# Altium schematic sheet MCU.SchDoc: MCU
size A3; CompanyName: Novelda AS; Organization: Novelda AS; Address1: Gjerdrums vei 8; Address2: NO-0484 Oslo; Address3: Norway; Revision: 1.A; SheetNumber: 3; SheetTotal: 3; Classification: Restricted; Size: A3; Project: X4M01; ProjectName: Prosject Name
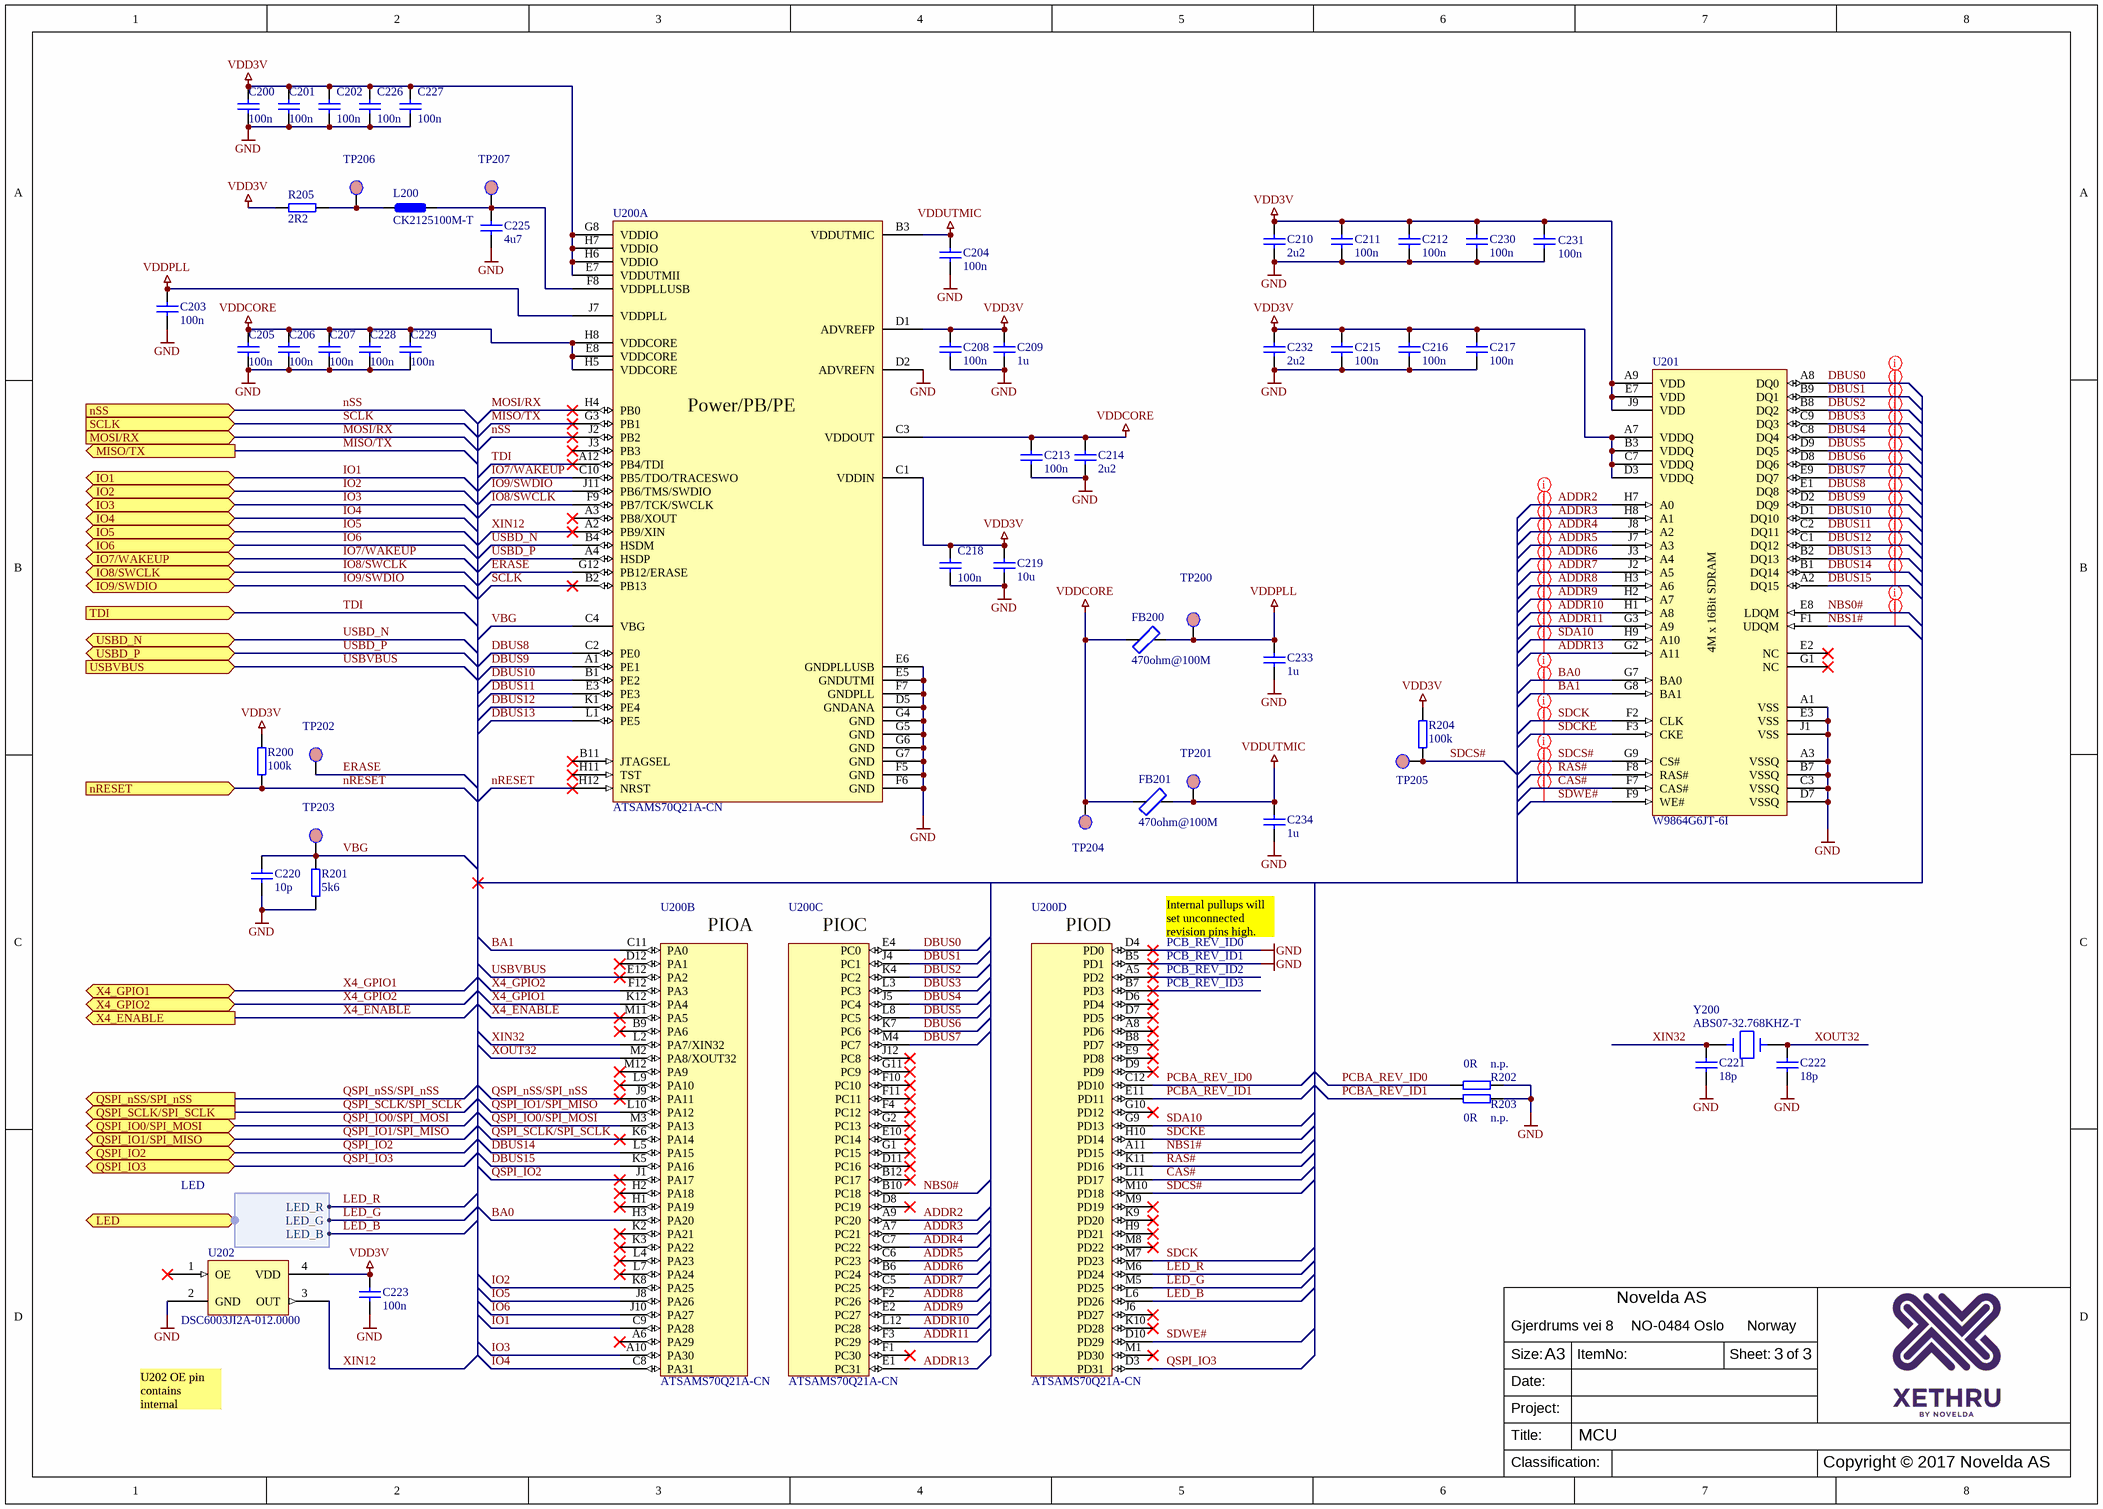
[diagram p0: MCU.SchDoc]

## Parts
C200  100n  [0402-CAPACITOR-NONPOL]
C201  100n  [0402-CAPACITOR-NONPOL]
C202  100n  [0402-CAPACITOR-NONPOL]
C203  100n  [0402-CAPACITOR-NONPOL]
C204  100n  [0402-CAPACITOR-NONPOL]
C205  100n  [0402-CAPACITOR-NONPOL]
C206  100n  [0402-CAPACITOR-NONPOL]
C207  100n  [0402-CAPACITOR-NONPOL]
C208  100n  [0402-CAPACITOR-NONPOL]
C209  1u  [0402-CAPACITOR-NONPOL]
C210  2u2  [0402-CAPACITOR-NONPOL]
C211  100n  [0402-CAPACITOR-NONPOL]
C212  100n  [0402-CAPACITOR-NONPOL]
C213  100n  [0402-CAPACITOR-NONPOL]
C214  2u2  [0402-CAPACITOR-NONPOL]
C215  100n  [0402-CAPACITOR-NONPOL]
C216  100n  [0402-CAPACITOR-NONPOL]
C217  100n  [0402-CAPACITOR-NONPOL]
C218  100n  [0402-CAPACITOR-NONPOL]
C219  10u  [0603-CAPACITOR-NONPOL]
C220  10p  [0402-CAPACITOR-NONPOL]
C221  18p  [0402-CAPACITOR-NONPOL]
C222  18p  [0402-CAPACITOR-NONPOL]
C223  100n  [0402-CAPACITOR-NONPOL]
C225  4u7  [0603-CAPACITOR-NONPOL]
C226  100n  [0402-CAPACITOR-NONPOL]
C227  100n  [0402-CAPACITOR-NONPOL]
C228  100n  [0402-CAPACITOR-NONPOL]
C229  100n  [0402-CAPACITOR-NONPOL]
C230  100n  [0402-CAPACITOR-NONPOL]
C231  100n  [0402-CAPACITOR-NONPOL]
C232  2u2  [0402-CAPACITOR-NONPOL]
C233  1u  [0402-CAPACITOR-NONPOL]
C234  1u  [0402-CAPACITOR-NONPOL]
FB200  470ohm@100M  [200047]
FB201  470ohm@100M  [200047]
L200  CK2125100M-T  [200364]
R200  100k  [0402-RESISTOR]
R201  5k6  [0402-RESISTOR]
R202  0R  Notes: n.p.  [0402-RESISTOR]
R203  0R  Notes: n.p.  [0402-RESISTOR]
R204  100k  [0402-RESISTOR]
R205  2R2  [0402-RESISTOR]
TP200  TP-MDA  [ALTIUM-0001]  (value not drawn)  (no BOM)
TP201  TP-MDA  [ALTIUM-0001]  (value not drawn)  (no BOM)
TP202  TP-MDA  [ALTIUM-0001]  (value not drawn)  (no BOM)
TP203  TP-MDA  [ALTIUM-0001]  (value not drawn)  (no BOM)
TP204  TP-MDA  [ALTIUM-0001]  (value not drawn)  (no BOM)
TP205  TP-MDA  [ALTIUM-0001]  (value not drawn)  (no BOM)
TP206  TP-MDA  [ALTIUM-0001]  (value not drawn)  (no BOM)
TP207  TP-MDA  [ALTIUM-0001]  (value not drawn)  (no BOM)
U200  ATSAMS70Q21A-CN  [200353]  (parts A,B,C,D of 4)
U201  W9864G6JT-6I  [200282]
U202  DSC6003JI2A-012.0000  [200365]
Y200  ABS07-32.768KHZ-T  [200042]

## Ports
IO1 (bidir), IO2 (bidir), IO3 (bidir), IO4 (bidir), IO5 (bidir), IO6 (bidir), IO7/WAKEUP (bidir), IO8/SWCLK (bidir), IO9/SWDIO (bidir), LED (harness LED), MISO/TX (out), MOSI/RX (in), nRESET (in), nSS (in), QSPI_IO0/SPI_MOSI (bidir), QSPI_IO1/SPI_MISO (bidir), QSPI_IO2 (bidir), QSPI_IO3 (bidir), QSPI_nSS/SPI_nSS (out), QSPI_SCLK/SPI_SCLK (out), SCLK (in), TDI (in), USBD_N (bidir), USBD_P (bidir), USBVBUS (in), X4_ENABLE (out), X4_GPIO1 (bidir), X4_GPIO2 (bidir)

## Harnesses
LED: LED_R, LED_B, LED_G

## Nets
GND: C200.2 C201.1 C202.1 C203.1 C204.1 C205.2 C206.1 C207.1 C208.1 C209.1 C210.2 C211.1 C212.1 C213.1 C214.2 C215.1 C216.1 C217.1 C218.1 C219.1 C220.2 C221.1 C222.1 C223.2 C225.1 C226.1 C227.1 C228.1 C229.1 C230.1 C231.1 C232.2 C233.1 C234.1 R201.1 R202.2 R203.2 U200.B5(PD1) U200.D2(ADVREFN) U200.D4(PD0) U200.D5(GNDANA) U200.E5(GNDUTMI) U200.E6(GNDPLLUSB) U200.F5(GND) U200.F6(GND) U200.F7(GNDPLL) U200.G4(GND) U200.G5(GND) U200.G6(GND) U200.G7(GND) U201.A1(VSS) U201.A3(VSSQ) U201.B7(VSSQ) U201.C3(VSSQ) U201.D7(VSSQ) U201.E3(VSS) U201.J1(VSS) U202.2(GND)
VDD3V: C200.1 C201.2 C202.2 C208.2 C209.2 C210.1 C211.2 C212.2 C215.2 C216.2 C217.2 C218.2 C219.2 C223.1 C226.2 C227.2 C230.2 C231.2 C232.1 R200.2 R204.2 R205.1 U200.C1(VDDIN) U200.D1(ADVREFP) U200.E7(VDDUTMII) U200.G8(VDDIO) U200.H6(VDDIO) U200.H7(VDDIO) U201.A7(VDDQ) U201.A9(VDD) U201.B3(VDDQ) U201.C7(VDDQ) U201.D3(VDDQ) U201.E7(VDD) U201.J9(VDD) U202.4(VDD)
VDDCORE: C205.1 C206.2 C207.2 C213.2 C214.1 C228.2 C229.2 FB200.1 FB201.1 TP204.1 U200.C3(VDDOUT) U200.E8(VDDCORE) U200.H5(VDDCORE) U200.H8(VDDCORE)
VDDPLL: C203.2 C233.2 FB200.2 TP200.1 U200.J7(VDDPLL)
VDDUTMIC: C204.2 C234.2 FB201.2 TP201.1 U200.B3(VDDUTMIC)
ADDR2: U200.A9(PC20) U201.H7(A0)
ADDR3: U200.A7(PC21) U201.H8(A1)
ADDR4: U200.C7(PC22) U201.J8(A2)
ADDR5: U200.C6(PC23) U201.J7(A3)
ADDR6: U200.B6(PC24) U201.J3(A4)
ADDR7: U200.C5(PC25) U201.J2(A5)
ADDR8: U200.F2(PC26) U201.H3(A6)
ADDR9: U200.E2(PC27) U201.H2(A7)
ADDR10: U200.L12(PC28) U201.H1(A8)
ADDR11: U200.F3(PC29) U201.G3(A9)
ADDR13: U200.E1(PC31) U201.G2(A11)
BA0: U200.H3(PA20) U201.G7(BA0)
BA1: U200.C11(PA0) U201.G8(BA1)
CAS#: U200.L11(PD17) U201.F7(CAS#)
DBUS0: U200.E4(PC0) U201.A8(DQ0)
DBUS1: U200.J4(PC1) U201.B9(DQ1)
DBUS2: U200.K4(PC2) U201.B8(DQ2)
DBUS3: U200.L3(PC3) U201.C9(DQ3)
DBUS4: U200.J5(PC4) U201.C8(DQ4)
DBUS5: U200.L8(PC5) U201.D9(DQ5)
DBUS6: U200.K7(PC6) U201.D8(DQ6)
DBUS7: U200.M4(PC7) U201.E9(DQ7)
DBUS8: U200.C2(PE0) U201.E1(DQ8)
DBUS9: U200.A1(PE1) U201.D2(DQ9)
DBUS10: U200.B1(PE2) U201.D1(DQ10)
DBUS11: U200.E3(PE3) U201.C2(DQ11)
DBUS12: U200.K1(PE4) U201.C1(DQ12)
DBUS13: U200.L1(PE5) U201.B2(DQ13)
DBUS14: U200.L5(PA15) U201.B1(DQ14)
DBUS15: U200.K5(PA16) U201.A2(DQ15)
ERASE: TP202.1 U200.G12(PB12/ERASE)
IO1: U200.C9(PA28) ; port IO1
IO2: U200.K8(PA25) ; port IO2
IO3: U200.A10(PA30) ; port IO3
IO4: U200.C8(PA31) ; port IO4
IO5: U200.J8(PA26) ; port IO5
IO6: U200.J10(PA27) ; port IO6
IO7/WAKEUP: U200.C10(PB5/TDO/TRACESWO) ; port IO7/WAKEUP
IO8/SWCLK: U200.F9(PB7/TCK/SWCLK) ; port IO8/SWCLK
IO9/SWDIO: U200.J11(PB6/TMS/SWDIO) ; port IO9/SWDIO
LED_B: U200.L6(PD26) ; port LED.LED_B
LED_G: U200.M5(PD25) ; port LED.LED_G
LED_R: U200.M6(PD24) ; port LED.LED_R
MISO/TX: U200.G3(PB1) ; port MISO/TX
MOSI/RX: U200.H4(PB0) ; port MOSI/RX
NBS0#: U200.B10(PC18) U201.E8(LDQM)
NBS1#: U200.A11(PD15) U201.F1(UDQM)
nRESET: R200.1 U200.H12(NRST) ; port nRESET
nSS: U200.J2(PB2) ; port nSS
PCBA_REV_ID0: R202.1 U200.C12(PD10)
PCBA_REV_ID1: R203.1 U200.E11(PD11)
QSPI_IO0/SPI_MOSI: U200.M3(PA13) ; port QSPI_IO0/SPI_MOSI
QSPI_IO1/SPI_MISO: U200.L10(PA12) ; port QSPI_IO1/SPI_MISO
QSPI_IO2: U200.J1(PA17) ; port QSPI_IO2
QSPI_IO3: U200.D3(PD31) ; port QSPI_IO3
QSPI_nSS/SPI_nSS: U200.J9(PA11) ; port QSPI_nSS/SPI_nSS
QSPI_SCLK/SPI_SCLK: U200.K6(PA14) ; port QSPI_SCLK/SPI_SCLK
RAS#: U200.K11(PD16) U201.F8(RAS#)
SCLK: U200.B2(PB13) ; port SCLK
SDA10: U200.G9(PD13) U201.H9(A10)
SDCK: U200.M7(PD23) U201.F2(CLK)
SDCKE: U200.H10(PD14) U201.F3(CKE)
SDCS#: R204.1 TP205.1 U200.M10(PD18) U201.G9(CS#)
SDWE#: U200.D10(PD29) U201.F9(WE#)
TDI: U200.A12(PB4/TDI) ; port TDI
USBD_N: U200.B4(HSDM) ; port USBD_N
USBD_P: U200.A4(HSDP) ; port USBD_P
USBVBUS: U200.E12(PA2) ; port USBVBUS
VBG: C220.1 R201.2 TP203.1 U200.C4(VBG)
X4_ENABLE: U200.M11(PA5) ; port X4_ENABLE
X4_GPIO1: U200.K12(PA4) ; port X4_GPIO1
X4_GPIO2: U200.F12(PA3) ; port X4_GPIO2
XIN12: U200.A2(PB9/XIN) U202.3(OUT)
XIN32: C221.2 U200.L2(PA7/XIN32) Y200.1
XOUT32: C222.2 U200.M2(PA8/XOUT32) Y200.2
NetC225_2: C225.2 L200.2 TP207.1 U200.F8(VDDPLLUSB)
NetL200_1: L200.1 R205.2 TP206.1

Not connected (* = marked no-connect by the designer): U200 A3(PB8/XOUT)* A5(PD2)* A6(PA29)* A8(PD6)* B7(PD3)* B8(PD7)* B9(PA6)* B11(JTAGSEL)* B12(PC17)* D6(PD4)* D7(PD5)* D8(PC19)* D9(PD9)* D11(PC16)* D12(PA1)* E9(PD8)* E10(PC14)* F1(PC30)* F4(PC12)* F10(PC10)* F11(PC11)* G1(PC15)* G2(PC13)* G10(PD12)* G11(PC9)* H1(PA19)* H2(PA18)* H9(PD21)* H11(TST)* J3(PB3)* J6(PD27)* J12(PC8)* K2(PA21)* K3(PA22)* K9(PD20)* K10(PD28)* L4(PA23)* L7(PA24)* L9(PA10)* M1(PD30)* M8(PD22)* M9(PD19)* M12(PA9)*; U201 E2(NC)* G1(NC)*; U202 1(OE)*

## Layout directives
net class ADDRESS_BUS: ADDR2, ADDR3, ADDR4, ADDR5, ADDR6, ADDR7, ADDR8, ADDR9, ADDR10, ADDR11, ADDR13, BA0, BA1, CAS#, NBS0#, NBS1#, RAS#, SDA10, SDCK, SDCKE, SDCS#, SDWE#
net class DATA_BUS: DBUS0, DBUS1, DBUS2, DBUS3, DBUS4, DBUS5, DBUS6, DBUS7, DBUS8, DBUS9, DBUS10, DBUS11, DBUS12, DBUS13, DBUS14, DBUS15

## Notes on the sheet
- PCB_REV_ID0
- PCB_REV_ID1
- PCB_REV_ID2
- PCB_REV_ID3
- Internal pullups will set unconnected revision pins high.
- U202 OE pin
  contains internal
  pull-up
- Size:
- Date:
- ItemNo:
- Sheet:
- of
- Title:
- Project:
- Classification:
- Copyright © 2017 Novelda AS
- (in symbol 200282) 4M x 16Bit SDRAM
- (in symbol 200353, part A) Power/PB/PE
- (in symbol 200353, part B) PIOA
- (in symbol 200353, part C) PIOC
- (in symbol 200353, part D) PIOD

## Library data of the parts
C200-C208 C211-C213 C215-C218 C223 C226-C231 = 200010: CAPACITOR, 100n, 0402, 10%, 10V, X5R; ItemNo: 200010; Component Status: Active; Value: 100n; Component Category: Capacitor; Manufacturer: --; Supplier: Farnell Norge; SupplierCatNo: 1759380
C209 C233 C234 = 200001: CAPACITOR, 1u, 0402, 10%, 10V, X5R; ItemNo: 200001; Component Status: Active; Value: 1u; Component Category: Capacitor; Manufacturer: --; Supplier: Farnell Norge; SupplierCatNo: 1759381
C210 C214 C232 = 200000: CAPACITOR, 2u2, 0402, 20%, 6V3, X5R; ItemNo: 200000; Component Status: Active; Value: 2u2; Component Category: Capacitor; Manufacturer: --; Supplier: Farnell Norge; SupplierCatNo: 2362091
C219 = 200011: CAPACITOR, 10u, 0603, 20%, 6V3, X5R; ItemNo: 200011; Component Status: Active; Value: 10u; Component Category: Capacitor; Manufacturer: --; Supplier: Farnell Norge; SupplierCatNo: 2611921
C220 = 200008: CAPACITOR, 10p, 0402, 5%, 50V, NP0; ItemNo: 200008; Component Status: Active; Value: 10p; Component Category: Capacitor; Manufacturer: --; Supplier: Farnell Norge; SupplierCatNo: 2320761
C221 C222 = 200012: CAPACITOR, 18p, 0402, 5%, 50V, NP0; ItemNo: 200012; Component Status: Active; Value: 18p; Component Category: Capacitor; Manufacturer: --; Supplier: Farnell Norge; SupplierCatNo: 1758947
C225 = 200128: CAPACITOR, 4u7, 0603, 10%, 10V, X5R; ItemNo: 200128; Component Status: Active; Value: 4u7; Component Category: Capacitor; Manufacturer: --; Supplier: Farnell Norge; SupplierCatNo: 2320818; ClassName: -; Notes: -
FB200 FB201 = 200047: FERRITE BEAD, 470ohm@100MHz, 1A; Manufacturer: Murata; MPN: BLM18PG471SN1D; Component Status: New; Component Category: Inductor; ItemNo: 200047; Value: 470ohm@100M; Supplier: Digi-Key; SupplierCatNo: 490-5223-1-ND
L200 = 200364: INDUCTOR, 10u, 0805, 20%, 60mA, 650mOhm; Manufacturer: TAIYO YUDEN; Component Status: New; ItemNo: 200364; Value: CK2125100M-T; Component Category: Inductor; MPN: CK2125100M-T; Supplier: Farnell Norge; SupplierCatNo: 2112892; ClassName: -; Notes: -
R200 R204 = 200027: RESISTOR, 100k, 0402, 1%, 63mW; ItemNo: 200027; Component Status: Active; Value: 100k; Component Category: Resistor; Manufacturer: --; Supplier: Farnell Norge; SupplierCatNo: 9239472
R201 = 200064: RESISTOR, 5k6, 0402, 1%, 63mW; ItemNo: 200064; Component Status: Active; Value: 5k6; Component Category: Resistor; Manufacturer: --; Supplier: Farnell Norge; SupplierCatNo: 2331549
R202 R203 = 200021: RESISTOR, 0R, 0402, 5%, 63mW; ItemNo: 200021; Component Status: Active; Value: 0R; Component Category: Resistor; Manufacturer: --; Supplier: Farnell Norge; SupplierCatNo: 1469661
R205 = 200024: RESISTOR, 2R2, 0402, 1%, 63mW; ItemNo: 200024; Component Status: Active; Value: 2R2; Component Category: Resistor; Manufacturer: --; Supplier: Digi-Key; SupplierCatNo: 541-2.20LLCT-ND
TP200-TP205 = ALTIUM-0023: TESTPOINT FOR MDA-TEST, 1mm ROUND, SMD; Component Status: Active; Component Category: Misc; TP_Type: MDA; ItemNo: ALTIUM-0023; Value: TP-MDA; ClassName: MDA-Testpoint
TP206 TP207 = ALTIUM-0023: TESTPOINT FOR MDA-TEST, 1mm ROUND, SMD; Component Status: Active; Component Category: Misc; ItemNo: ALTIUM-0023; Value: TP-MDA; ClassName: MDA-Testpoint; Notes: -; TP_Type: -; TP_LegalValueRange: -; TP_Notes: -
U200 = 200353: ATSAMS70Q21A-CN, MCU, LFBGA144, 2048k Flash, 384k SRAM; Manufacturer: Atmel; Component Status: New; Component Category: Microcontroller IC; ItemNo: 200353; Value: ATSAMS70Q21A-CN; MPN: ATSAMS70Q21A-CN; Supplier: Farnell Norge; SupplierCatNo: 2484398; ClassName: -; Notes: -
U201 = 200282: IC, SYNCHRONOUS DRAM (SDRAM), 64MBIT, 6NS, 166MHZ, 4M x 16BIT, 54FBGA; Manufacturer: Winbond Electronics Corp.; Component Status: New; Component Category: Misc IC; ItemNo: 200282; Value: W9864G6JT-6I; MPN: W9864G6JT-6I; ClassName: -; Notes: -; Supplier: Digi-Key; SupplierCatNo: 1450-1257-ND
U202 = 200365: DSC6003JI2A-012.0000, 12MHZ CMOS MEMS OSCILLATOR 2.5X2MM; Manufacturer: Microchip Technology; Component Status: Active; Component Category: Misc; ItemNo: 200365; Value: DSC6003JI2A-012.0000; MPN: DSC6003JI2A-012.0000; Supplier: Digi-Key; SupplierCatNo: DSC6003JI2A-012.0000-ND; ClassName: -; Notes: -
Y200 = 200042: CRYSTAL, 32.768KHZ, 12.5PF, SMD; Manufacturer: Abracon; Component Status: Active; ItemNo: 200042; Value: ABS07-32.768KHZ-T; Component Category: Crystal; MPN: ABS07-32.768KHZ-T; Supplier: Farnell Norge; SupplierCatNo: 2101347